# Altium schematic sheet LCD.SchDoc
size A
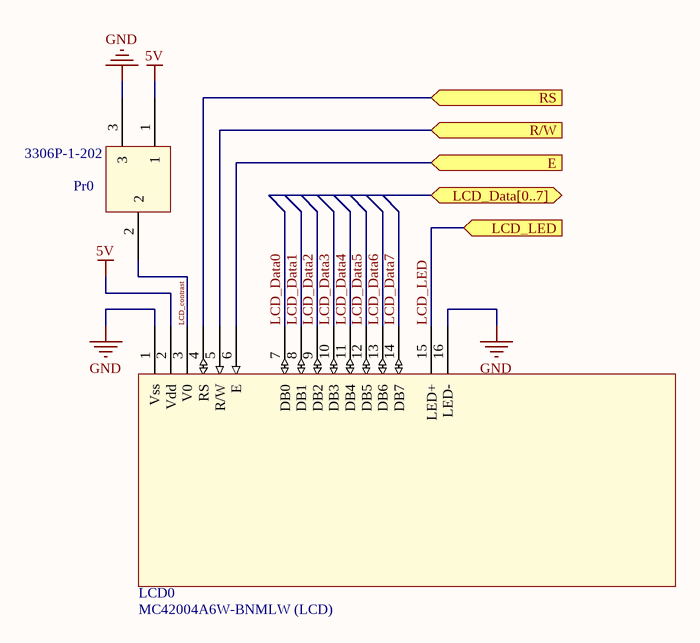
[diagram p0: LCD.SchDoc]

## Parts
LCD0  MC42004A6W-BNMLW (LCD)  [PCBComponent_1]
Pr0  3306P-1-202  [3306P-1-202]

## Ports
E (in), LCD_Data[0..7] (bidir), LCD_LED (in), R/W (in), RS (in)

## Nets
5V: LCD0.2(Vdd) Pr0.1
GND: LCD0.1(Vss) LCD0.16(LED-) Pr0.3
E: LCD0.6(E) ; port E
LCD_contrast: LCD0.3(V0) Pr0.2
LCD_Data0: LCD0.7(DB0)
LCD_Data1: LCD0.8(DB1)
LCD_Data2: LCD0.9(DB2)
LCD_Data3: LCD0.10(DB3)
LCD_Data4: LCD0.11(DB4)
LCD_Data5: LCD0.12(DB5)
LCD_Data6: LCD0.13(DB6)
LCD_Data7: LCD0.14(DB7)
LCD_LED: LCD0.15(LED+) ; port LCD_LED
R/W: LCD0.5(R/W) ; port R/W
RS: LCD0.4(RS) ; port RS